# Altium schematic sheet JacDacMicroBitShieldLP 29.SchDoc: complete design
size A4; DocumentNumber: 1; SheetNumber: 1; SheetTotal: 2; VersionControl_RevNumber: 1
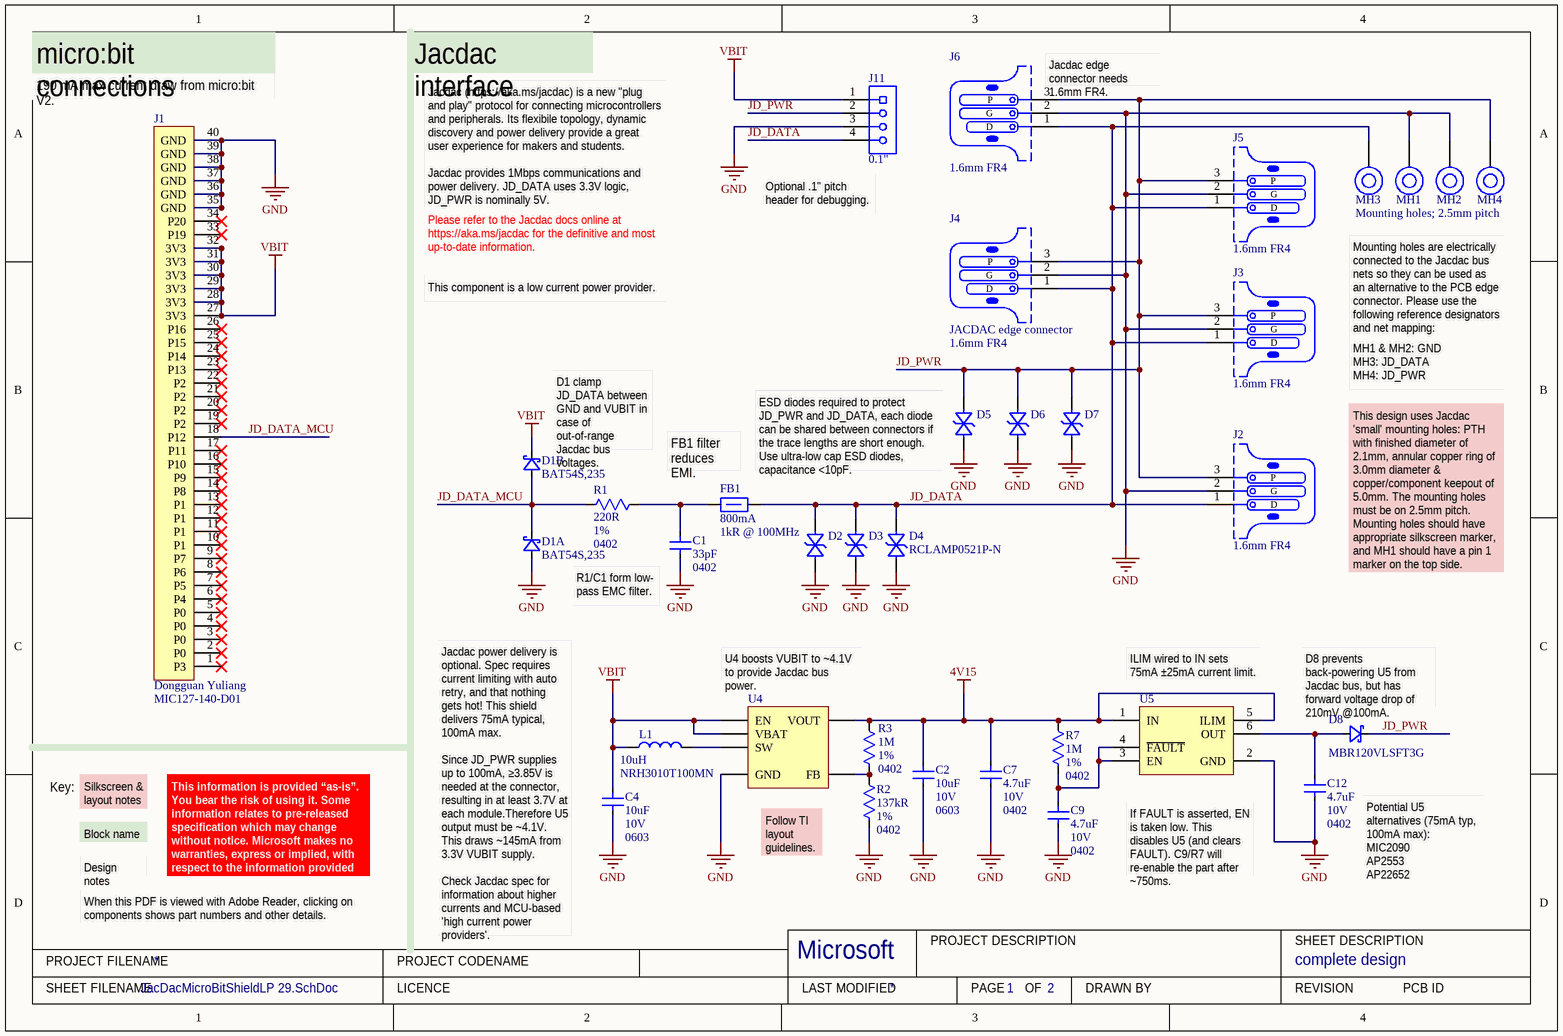
[diagram p0: JacDacMicroBitShieldLP 29.SchDoc]

## Parts
C1  Capacitance: 33pF  Case Code (Imperial): 0402  [C0402_0.55MM - without outline]  (hidden comment: CL05C330JB51PNC)
C2  Capacitance: 10uF  Voltage Rating: 10V  Case Code (Imperial): 0603  [C0603 - without outline]  (hidden comment: CL10A106KP8NNNC)
C4  Capacitance: 10uF  Voltage Rating: 10V  Case Code (Imperial): 0603  [C0603 - without outline]  (hidden comment: CL10A106KP8NNNC)
C7  Capacitance: 4.7uF  Voltage Rating: 10V  Case Code (Imperial): 0402  [R0402 - Without outline]  (hidden comment: CL05A475MP5NRNC)
C9  Capacitance: 4.7uF  Voltage Rating: 10V  Case Code (Imperial): 0402  [R0402 - Without outline]  (hidden comment: CL05A475MP5NRNC)
C12  Capacitance: 4.7uF  Voltage Rating: 10V  Case Code (Imperial): 0402  [R0402 - Without outline]  (hidden comment: CL05A475MP5NRNC)
D1  Manufacturer Part Number: BAT54S,235  [NXP-BAT54S-TO-236AB - without outline]  (hidden comment: BAT54S)  (parts A,B of 2)
D2  RCLAMP0521P-N  [TVS 0402 - L]  (value not drawn)
D3  RCLAMP0521P-N  [TVS 0402 - L]  (value not drawn)
D4  RCLAMP0521P-N  [TVS 0402 - L]
D5  RCLAMP0521P-N  [TVS 0402 - L]  (value not drawn)
D6  RCLAMP0521P-N  [TVS 0402 - L]  (value not drawn)
D7  RCLAMP0521P-N  [TVS 0402 - L]  (value not drawn)
D8  MBR120VLSFT3G  [MBR120VLSFT3G]
FB1  Current Rating: 800mA  Impedance: 1kR @ 100MHz  [TDK MPZ1608 0.8mm - without outline]  (hidden comment: TDK MPZ1608S102ATA00)
J1  Manufacturer: Dongguan Yuliang  [MIC127-140-D01]  (hidden comment: Planar 1x40p 1.27 mm pitch edge connector for the micro:bit)
J2  PCB Type: 1.6mm FR4  [JACDAC_EDGE_CONNECTOR_NO_TRACES]  (hidden comment: Jacdac edge connector)  (no BOM)
J3  PCB Type: 1.6mm FR4  [JACDAC_EDGE_CONNECTOR_NO_TRACES]  (hidden comment: Jacdac edge connector)  (no BOM)
J4  JACDAC edge connector  PCB Type: 1.6mm FR4  [JACDAC_EDGE_CONNECTOR_NO_TRACES]  (no BOM)
J5  PCB Type: 1.6mm FR4  [JACDAC_EDGE_CONNECTOR_NO_TRACES]  (hidden comment: Jacdac edge connector)  (no BOM)
J6  PCB Type: 1.6mm FR4  [JACDAC_EDGE_CONNECTOR_NO_TRACES]  (hidden comment: Jacdac edge connector)  (no BOM)
J11  0.1"  [Generic 1x4 2.54mm header]  (no BOM)
L1  Inductance: 10uH  [NRH3010T100MN]  (hidden comment: NRH3010T100MN)
MH1  (no value)  [MH_5.0MMK_3.0MMC_2.1MMD_PTH]  (no BOM)
MH2  Mounting holes; 2.5 mm pitch  [MH_5.0MMK_3.0MMC_2.1MMD_PTH]  (value not drawn)  (no BOM)
MH3  Mounting holes; 2.5mm pitch  [MH_5.0MMK_3.0MMC_2.1MMD_PTH]  (no BOM)
MH4  MH_5.0MMK_3.0MMC_2.1MMD_PTH  [MH_5.0MMK_3.0MMC_2.1MMD_PTH]  (value not drawn)  (no BOM)
R1  Resistance: 220R  Tolerance: 1%  Case Code (Imperial): 0402  [R0402 - Without outline]  (hidden comment: 0402WGF2200TCE)
R2  Resistance: 137kR  Tolerance: 1%  Case Code (Imperial): 0402  [R0402 - Without outline]  (hidden comment: RC0402FR-07137KL)
R3  Resistance: 1M  Tolerance: 1%  Case Code (Imperial): 0402  [R0402 - Without outline]  (hidden comment: 0402WGF1004TCE)
R7  Resistance: 1M  Tolerance: 1%  Case Code (Imperial): 0402  [R0402 - Without outline]  (hidden comment: 0402WGF1004TCE)
U4  TLV61220  [TI-TLV61220 - without_outline]  (value not drawn)
U5  TPS2553DBVR  [TI-TPS2553 - without_outline]  (value not drawn)

## Nets
4V15: C2.2 C7.2 R3.2 R7.2 U4.5(VOUT) U5.1(IN) U5.5(ILIM)
GND: C1.1 C2.1 C4.1 C7.1 C9.1 C12.1 D1.1(A) D2.2(A) D3.2(A) D4.2(A) D5.2(A) D6.2(A) D7.2(A) J1.35(GND) J1.36(GND) J1.37(GND) J1.38(GND) J1.39(GND) J1.40(GND) J2.2(G) J3.2(G) J4.2(G) J5.2(G) J6.2(G) J11.3 MH1.1 MH2.1 R2.1 U4.2(GND) U5.2(GND)
VBIT: C4.2 D1.2(K) J1.27(3V3) J1.28(3V3) J1.29(3V3) J1.30(3V3) J1.31(3V3) J1.32(3V3) J11.1 L1.1 U4.3(EN) U4.6(VBAT)
JD_DATA: D2.1(K) D3.1(K) D4.1(K) FB1.1 J2.1(D) J3.1(D) J4.1(D) J5.1(D) J6.1(D) J11.4 MH3.1
JD_DATA_MCU: D1.3(K) J1.18(P12) R1.1
JD_PWR: D5.1(K) D6.1(K) D7.1(K) D8.1(K) J2.3(P) J3.3(P) J4.3(P) J5.3(P) J6.3(P) J11.2 MH4.1
NetC1_2: C1.2 FB1.2 R1.2
NetC9_2: C9.2 R7.1 U5.3(EN) U5.4(~{FAULT})
NetC12_2: C12.2 D8.2(A) U5.6(OUT)
NetL1_2: L1.2 U4.1(SW)
NetR2_2: R2.2 R3.1 U4.4(FB)

Not connected (* = marked no-connect by the designer): J1 1(P3)* 2(P0)* 3(P0)* 4(P0)* 5(P0)* 6(P4)* 7(P5)* 8(P6)* 9(P7)* 10(P1)* 11(P1)* 12(P1)* 13(P1)* 14(P8)* 15(P9)* 16(P10)* 17(P11)* 19(P2)* 20(P2)* 21(P2)* 22(P2)* 23(P13)* 24(P14)* 25(P15)* 26(P16)* 33(P19)* 34(P20)*

## Notes on the sheet
- (near J1) 190 mA max current draw from micro:bit V2.
- micro:bit connections
- Jacdac interface
- (near J6) Jacdac edge connector needs 1.6mm FR4.
- Jacdac (https://aka.ms/jacdac) is a new "plug and play" protocol for connecting microcontrollers and peripherals. Its flexibile topology, dynamic discovery and power delivery provide a great user experience for makers and students.
  Jacdac provides 1Mbps communications and power delivery. JD_DATA uses 3.3V logic, JD_PWR is nominally 5V.
- (near J11) Optional .1" pitch header for debugging.
- Please refer to the Jacdac docs online at https://aka.ms/jacdac for the definitive and most up-to-date information.
- This component is a low current power provider.
- MH1 & MH2: GND
  MH3: JD_DATA
  MH4: JD_PWR
- Mounting holes are electrically connected to the Jacdac bus nets so they can be used as an alternative to the PCB edge connector. Please use the following reference designators and net mapping:
- (near D1) D1 clamp JD_DATA between GND and VUBIT in case of out-of-range Jacdac bus voltages.
- FB1 filter reduces EMI.
- ESD diodes required to protect JD_PWR and JD_DATA, each diode can be shared between connectors if the trace lengths are short enough. Use ultra-low cap ESD diodes, capacitance <10pF.
- This design uses Jacdac 'small' mounting holes: PTH with finished diameter of 2.1mm, annular copper ring of 3.0mm diameter & copper/component keepout of 5.0mm. The mounting holes must be on 2.5mm pitch.
  Mounting holes should have appropriate silkscreen marker, and MH1 should have a pin 1 marker on the top side.
- (near C1) R1/C1 form low-
  pass EMC filter.
- U4 boosts VUBIT to ~4.1V to provide Jacdac bus power.
- (near U5) ILIM wired to IN sets 75mA ±25mA current limit.
- (near D8) D8 prevents back-powering U5 from Jacdac bus, but has forward voltage drop of 210mV @100mA.
- Key:
- Block name
- Silkscreen & layout notes
- Follow TI layout guidelines.
- Design notes
- When this PDF is viewed with Adobe Reader, clicking on components shows part numbers and other details.
- This information is provided “as-is”. You bear the risk of using it. Some information relates to pre-released specification which may change without notice. Microsoft makes no warranties, express or implied, with respect to the information provided here.
- If FAULT is asserted, EN is taken low. This disables U5 (and clears FAULT). C9/R7 will re-enable the part after ~750ms.
- Potential U5 alternatives (75mA typ, 100mA max):
  MIC2090
  AP2553
  AP22652
- (near C4) Jacdac power delivery is optional. Spec requires current limiting with auto retry, and that nothing gets hot! This shield delivers 75mA typical, 100mA max.
  Since JD_PWR supplies up to 100mA, ≥3.85V is needed at the connector, resulting in at least 3.7V at each module.Therefore U5 output must be ~4.1V. This draws ~145mA from 3.3V VUBIT supply.
  Check Jacdac spec for information about higher currents and MCU-based 'high current power providers'.
- PROJECT FILENAME
- PROJECT CODENAME
- Microsoft
- PROJECT DESCRIPTION
- SHEET DESCRIPTION
- SHEET FILENAME
- LICENCE
- LAST MODIFIED
- PAGE
- OF
- DRAWN BY
- REVISION
- PCB ID

## Library data of the parts
C1 = CL05C330JB51PNC: CAP CER 33PF 50V NP0 0402; Manufacturer: Samsung; Tolerance: 5%; Supplier 1: Digi-Key; Manufacturer Part Number: CL05C330JB51PNC; RoHS: Yes; Category: Capacitors; Stock 1: 250654; Pricing 1: 1=0.10000, 10=0.07500, 50=0.04060, 100=0.03320, 500=0.02374, 1000=0.01865, 2500=0.01696, 5000=0.01560 (USD); Mount: Surface Mount; Case/Package: 0402; Case Code (Metric): 1005; Min Operating Temperature: -55°C; Max Operating Temperature: 125°C; Packaging: Tape and Reel; Length: 0.039inch; Width: 0.02inch; Thickness: 0.022inch; Ratings: AEC-Q200; Lead Free: Lead Free; ComponentLink1URL: http://www.samsungsem.com/kr/support/library/product-catalog/mlcc.jsp; ComponentLink1Description: Samsung datasheet online; Supplier 2: Mouser; Stock 2: 97900; Pricing 2: 1=0.11000, 10=0.08200, 100=0.03600, 500=0.02600, 1000=0.02000, 2500=0.01800 (USD); Supplier 3: Future Electronics; Stock 3: 100000; Pricing 3: 10000=0.00780 (USD); Supplier Part Number 3: 6022520; Supplier Part Number 2: 187-CL05C330JB51PNC; Checked: ?; Created: DG; Supplier Part Number 1: 1276-6515-1-ND; Voltage Rating: 50V
C2 C4 = CL10A106KP8NNNC: CAP CER 10UF 10V X5R 0603; Manufacturer: Samsung; Material: Ceramic; Tolerance: 10%; Supplier 1: Digi-Key; Manufacturer Part Number: CL10A106KP8NNNC; RoHS: Yes; Category: Ceramic Capacitors; Stock 1: 1098575; Pricing 1: 1=0.21000, 10=0.14800, 50=0.08420, 100=0.06980, 500=0.04892, 1000=0.04050 (USD); Mount: Surface Mount; Case/Package: 0603; Case Code (Metric): 1608; Contact Plating: Tin; Min Operating Temperature: -55°C; Max Operating Temperature: 85°C; Dielectric: X5R; Package Quantity: 1; Packaging: Tape and Reel; Length: 1.6mm; Width: 0.031inch; Height: 0.8mm; Thickness: 0.035inch; Depth: 0.8mm; Radiation Hardening: No; Lead Free: Lead Free; ComponentLink1URL: https://datasheet.ciiva.com/26877/getdatasheetpartid-359551-26877881.pdf; ComponentLink1Description: Online datasheet; Supplier 2: Mouser; Stock 2: 194338; Pricing 2: 1=0.19000, 10=0.13200, 100=0.06700, 500=0.04500, 1000=0.04000, 2500=0.03400 (USD); Supplier 3: Farnell; Stock 3: 11777; Pricing 3: 10=0.08380, 100=0.06930, 500=0.04170, 1000=0.03410, 2000=0.03370, 4000=0.02700, 20000=0.02200 (GBP); Supplier Part Number 3: 3013386; Supplier Part Number 2: 187-CL10A106KP8NNNC; Supplier Part Number 1: 1276-1192-1-ND; Voltage Rating (DC): 10V
C7 C9 C12 = CL05A475MP5NRNC: CAP CER 4.7UF 10V X5R 0402; Manufacturer: Samsung; Tolerance: 20%; Supplier 1: Digi-Key; Manufacturer Part Number: CL05A475MP5NRNC; RoHS: Yes; Category: Ceramic Capacitors; Stock 1: 840000; Pricing 1: 10000=0.01405, 20000=0.01338 (USD); Mount: Surface Mount; Case/Package: 0402; Case Code (Metric): 1005; Min Operating Temperature: -55°C; Max Operating Temperature: 85°C; Package Quantity: 10000; Packaging: Tape and Reel; Dielectric: X5R; Series: CL; Length: 0.039inch; Width: 0.02inch; Thickness: 0.022inch; Lead Free: Lead Free; RoHS Compliant: Yes; ComponentLink1URL: https://datasheet.ciiva.com/25786/cl05a475mp5nrnc-25786963.pdf; ComponentLink1Description: Online datasheet; Supplier 2: Future Electronics; Stock 2: 2004; Pricing 2: 1=0.23500, 500=0.03970, 1500=0.02900, 2500=0.02500, 5000=0.02050 (USD); Created By: D. Gakure; Checked By: ?; Supplier Part Number 2: 2103694; Supplier Part Number 1: 1276-1482-2-ND
D1 = BAT54S: DIODE ARRAY SCHOTTKY 30V SOT23; Manufacturer: Nexperia; Supplier 1: Digi-Key; RoHS: No; Category: Rectifier Diodes; Stock 1: 14011; Pricing 1: 1=0.13000, 10=0.11900, 100=0.05610, 500=0.03326, 1000=0.02185, 5000=0.02138 (USD); ComponentLink1URL: https://assets.nexperia.com/documents/data-sheet/BAT54_SER.pdf; ComponentLink1Description: NXP datasheet online; Supplier 2: Mouser; Supplier 3: RSComponents; Supplier Part Number 2: 771-BAT54S235; Supplier Part Number 3: 1707990; Supplier Part Number 1: 1727-1868-1-ND
D2-D7 = RCLAMP0521P-N: Bidirectional 5V (Max) 6V 16V 3.5A (8/20us) 0402 TVS RoHS; Manufacturer: Born Semiconductor; Package: 0402; Created By: D Gakure; Checked By: ?; Supplier1: LCSC; Supplier1 Part Number: C316043; ComponentLink1Description: Online datasheet; ComponentLink1URL: https://datasheet.lcsc.com/szlcsc/Bourne-Semicon-Shenzhen-RCLAMP0521P-N_C316043.pdf; Manufacturer Part Number: RCLAMP0521P-N
D8 = MBR120VLSFT3G: DIODE SCHOTTKY 20V 1A SOD123FL; Manufacturer: ON Semiconductor; Max Surge Current: 45A; Forward Voltage: 340mV; Peak Reverse Current: 600uA; Element Configuration: Single; Polarity: Standard; Supplier 1: Digi-Key; RoHS: Yes; Category: Schottky Diodes; Stock 1: 32481; Pricing 1: 1=0.39000, 10=0.28600, 100=0.19920, 500=0.12616, 1000=0.10292, 2000=0.09960, 5000=0.09628 (USD); Number of Pins: 2; Min Operating Temperature: -65°C; Max Operating Temperature: 125°C; Package Quantity: 10000; Forward Current: 1A; Packaging: Tape and Reel; Max Reverse Leakage Current: 600uA; Average Rectified Current: 1A; Peak Non-Repetitive Surge Current: 45A; Max Repetitive Reverse Voltage (Vrrm): 20V; Max Forward Surge Current (Ifsm): 45A; Voltage Rating (DC): 20V; Current Rating: 1A; Output Current: 1A; Max Reverse Voltage (DC): 20V; Radiation Hardening: No; REACH SVHC: No SVHC; Lead Free: Lead Free; Halogen Free: Halogen Free; ComponentLink4URL: https://datasheet.ciiva.com/6380/mbr120vlsft1-d-6380910.pdf; ComponentLink4Description: On Semi datasheet online; Supplier 2: Mouser; Supplier 3: RSComponents; Supplier Part Number 3: 1867479; Supplier Part Number 2: 863-MBR120VLSFT3G; Supplier Part Number 1: MBR120VLSFT3GOSCT-ND; Manufacturer Part Number: MBR120VLSFT3G
FB1 = TDK MPZ1608S102ATA00: 0603 1k@100MHz 0.8A chip; Core Material: Ferrite; Tolerance: 25%; DC Resistance (DCR): 300mR; Supplier 1: Digi-Key; Stock 1: 113542; Pricing 1: 1=0.1, 10=0.079, 25=0.0716, 50=0.0644, 100=0.0472, 250=0.03432, 500=0.03146, 1000=0.02717 (USD); Mount: Surface Mount; Case/Package: 0603; Case Code (Metric): 1608; Case Code (Imperial): 0603; Package Quantity: 4000; Packaging: Tape and Reel; Max DC Current: 800mA; Length: 0.063inch; Height: 0.037inch; Width: 0.031inch; ComponentLink2URL: https://www.mouser.co.uk/datasheet/2/400/eads_commercial_power_mpz1608_en-923650.pdf; ComponentLink2Description: datasheet online; Supplier 2: Mouser; ComponentLink3Description: datasheet; ComponentLink3URL: Y:\System\Altium\Libraries 2014\TDK\Datasheets\eads_commercial_power_mpz1608_en-923650.pdf; Supplier Part Number 1: 445-8694-1-ND; Supplier Part Number 2: 810-MPZ1608S102ATA00; Manufacturer: TDK; Manufacturer Part Number: MPZ1608S102ATA00
J1 = MIC127-140-D01: "Same plane" 1x40p 1.27mm Dongguan Yuliang BBC micro:bit edge connector; ComponentLink1Description: Yuliang drawing; ComponentLink1URL: Y:\System\Altium\Libraries 2014\Yuliang\Datasheets\YULIANG-MIC127-140-D01.pdf; Manufacturer Part Number: MIC127-140-D01; ComponentLink2Description: Yuliang drawing online; ComponentLink2URL: http://www.dgyuliang.net/d/file/Produtcs/Customized%20Connector/MICRO%20BIT%20Connector/aff70b8859d81d58072ddeb323d41b1d.pdf
J2 J3 J5 J6 = Jacdac edge connector: 3 pin jacdac edge connector 1.27mm pitch; Manufacturer Part Number: JACDAC_EDGE_CONNECTOR; Checked By: ?; Created By: D. Gakure; ComponentLink1Description: Yuliang JACDAC cable connector drawing online; ComponentLink1URL: https://github.com/microsoft/jacdac-mdk/blob/main/connector/JACDAC-Connector-by-Yuliang-2020-11-28.pdf; ComponentLink2Description: JACDAC PCB edge connector spec onlin; ComponentLink2URL: https://github.com/microsoft/jacdac-mdk/blob/main/connector/JACDAC_PCB_Edge_Connector_Drawing_JD-PEC-01_rev_01.pdf
J4 = JACDAC edge connector: 3 pin jacdac edge connector 1.27mm pitch; Manufacturer Part Number: JACDAC_EDGE_CONNECTOR; Checked By: ?; Created By: D. Gakure; ComponentLink1Description: Yuliang JACDAC cable connector drawing online; ComponentLink1URL: https://github.com/microsoft/jacdac-mdk/blob/main/connector/JACDAC-Connector-by-Yuliang-2020-11-28.pdf; ComponentLink2Description: JACDAC PCB edge connector spec onlin; ComponentLink2URL: https://github.com/microsoft/jacdac-mdk/blob/main/connector/JACDAC_PCB_Edge_Connector_Drawing_JD-PEC-01_rev_01.pdf
J11 = Header Multicomp 2211S-04G-whitesch: 2.54mm, 4x1 way, vertical, square pin, gold plate; Pitch Spacing: 2.54; No. of Contacts: 4; Gender: Header; Product Range: 2211; Contact Termination Type: Through Hole; No. of Rows: 1; SVHC: No SVHC (17-Dec-2015); Contact Resistance: 20; Contact Termination: Solder; Current Rating: 3; Insulation Resistance: 1000; Voltage Rating V AC: 250; Withstand Voltage: 600V<!--FANDB--><div class="features-and-benefits-container"><div class="features-and-benefits-description"><span class="features-benefits-value">The 2211S-04G is a 4-pin 1-row PCB Header with gold plated copper alloy contacts and a black high temperature plastic (PBT) insulator. This board-to-board holder is ideal for through hole vertical mounting.</span></div><div class="features-and-benefits-list"><ul class="features-and-benefits-list-list"><li class="features-and-benefits-list-item">3A AC/DC Rated current</li><li class="features-and-benefits-list-item">250VAC/DC Rated voltage</li><li class="features-and-benefits-list-item">20; Created By: HUGHWI; Supplier 1: Farnell; Manufacturer: Multicomp; Manufacturer Part Number: 2211S-04G; RoHS: YES; Stock 1: 2760; Pricing 1: 1=0.0973, 5=0.0918, 25=0.0864, 50=0.0808, 100=0.0753, 250=0.032 (GBP); Contact Plating: Gold Plated Contacts; Contact Material: Copper Alloy; Flammability Rating: UL94V-0; Lead Spacing: 2.54; Operating Temperature Max: 105; Operating Temperature Min: -40; Termination Method: Solder; ComponentLink1URL: http://www.farnell.com/datasheets/1518407.pdf; ComponentLink1Description: header strip datasheet; Supplier Part Number 1: 1593413
L1 = NRH3010T100MN: Inductor, Shielded, 10uH, 600mA, SMD; NRH Series; Inductance:10 H; Inductance Tolerance: 20%; Inductor Construction:Shielded; DC Resistance Max:0.35ohm; RMS Current (Irms):620mA; Saturation Current (Isat):600mA ;RoHS Compliant: Yes; Manufacturer: Taiyo Yuden; Core Material: Ferrite; DC Resistance (DCR): 350mR; Test Frequency: 100kHz; Self Resonant Frequency: 34MHz; Current Rating: 620mA; Supplier 1: Digi-Key; RoHS: Yes; Category: Fixed Inductors; Stock 1: 2000; Pricing 1: 1=0.31000, 10=0.27600, 25=0.24120, 50=0.20680, 100=0.18950, 250=0.17224, 500=0.16192, 1000=0.12402 (USD); Mount: Surface Mount; Case/Package: 3010; Min Operating Temperature: -25°C; Max Operating Temperature: 120°C; Max DC Current: 600mA; Tolerance: 20%; Termination: SMD/SMT; Package Quantity: 2000; Packaging: Tape and Reel; Shielding: Shielded; Composition: Wirewound; Saturation Current: 600mA; RMS Current (Irms): 620mA; Length: 3mm; Height: 1mm; Height - Seated (Max): 0.039inch; Depth: 3.1mm; Width: 3mm; Radiation Hardening: No; Halogen Free: Halogen Free; Lead Free: Lead Free; REACH SVHC: Unknown; ComponentLink2URL: https://datasheet.ciiva.com/1043/nrh3010t100mn-ss-1043273.pdf; ComponentLink2Description: Taiyo Yuden spec sheet online; ComponentLink3URL: https://datasheet.ciiva.com/8002/wound04-e-8002182.pdf?src-supplier=Element14; ComponentLink3Description: Taiyo Yuden data sheet (2015) online; Supplier 2: Mouser; Supplier Part Number 2: 963-NRH3010T100MN; Supplier Part Number 1: 587-2575-1-ND; Manufacturer Part Number: NRH3010T100MN
MH1-MH4 = MH_5.0MMK_3.0MMC_2.1MMD_PTH: Mounting Hole 5.0mm keepout, 3.0mm annualar ring and 2.1mm Drill PTH
R1 = 0402WGF2200TCE: RES SMD 220 OHM 1% 1/16W 0402; Manufacturer: Uniroyal Elec; Manufacturer Part Number: 0402WGF2200TCE
R2 = RC0402FR-07137KL: RES SMD 137K OHM 1% 1/16W 0402; Manufacturer: Yageo; Temperature Coefficient: 100ppm/°C; Power Rating: 62.5mW; Voltage Rating: 50V; Max Power Dissipation: 63mW; Supplier 1: Digi-Key; Manufacturer Part Number: RC0402FR-07137KL; RoHS: Yes; Category: Chip SMD Resistors; Stock 1: 47599; Pricing 1: 1=0.10000, 10=0.01600, 100=0.00660, 1000=0.00299, 2500=0.00259, 5000=0.00214 (USD); Case/Package: 0402; Contact Plating: Tin,Matte; Case Code (Metric): 1005; Min Operating Temperature: -55°C; Max Operating Temperature: 155°C; Resistor Type: Thick Film; Packaging: Tape and Reel; Number of Terminations: 2; Termination: SMD/SMT; Working Voltage: 50V; Features: Moisture Resistant; Series: RC; Construction: Rectangular; Technology: THICK FILM; Length: 1mm; Width: 0.02inch; Height: 0.016inch; Depth: 0.5mm; Military Standard: Not; Lead Free: Lead Free; RoHS Compliant: Yes; ComponentLink1URL: https://datasheet.ciiva.com/16744/pyu-rc0402-51-rohs-l-6-r-16744009.pdf; ComponentLink1Description: Online datasheet; Supplier 2: Avnet; Pricing 2: 10000=0.00090, 20000=0.00088, 40000=0.00086, 60000=0.00084, 80000=0.00081, 100000=0.00079, 1000000=0.00077 (USD); Supplier 3: Mouser; Pricing 3: 1=0.10000, 10=0.01600, 50=0.01600, 100=0.00600, 1000=0.00300, 10000=0.00100 (USD); Supplier Part Number 3: 603-RC0402FR-07137KL; Supplier Part Number 2: RC0402FR-07137KL; Supplier Part Number 1: YAG2972CT-ND
R3 R7 = 0402WGF1004TCE: RES SMD 1M OHM 1% 1/16W 0402; Manufacturer: Uniroyal Elec; Manufacturer Part Number: 0402WGF1004TCE
U4 = TLV61220: IC REG BST ADJ 0.22A SYNC SOT23; Manufacturer 1: Texas Instruments; Manufacturer Part Number: TLV61220DBVR; Output Voltage: 5.5V; Number of Outputs: 1; Output Current: 200mA; Min Input Voltage: 700mV; Synchronous Rectifier: Yes; Switching Frequency: 2MHz; Max Output Current: 400mA; Output Type: Adjustable; Efficiency: 95%; Min Output Voltage: 1.8V; Quiescent Current: 5uA; Topology: Boost; Output Configuration: Positive; Supplier 1: Digi-Key; RoHS: Yes; Category: Voltage Regulators - Switching; Stock 1: 42159; Pricing 1: 1=0.99000, 10=0.88500, 25=0.84000, 100=0.64500, 250=0.57000, 500=0.54000, 1000=0.42000 (USD); Mount: Surface Mount; Case/Package: SOT-23-6; Number of Pins: 6; Min Operating Temperature: -40°C; Max Operating Temperature: 85°C; Package Quantity: 1; Packaging: Tape and Reel; Max Input Voltage: 5.5V; Max Output Voltage: 5.5V; Length: 3.05mm; Height: 1.3mm; Width: 1.75mm; Radiation Hardening: No; Lead Free: Lead Free; REACH SVHC: No SVHC; ComponentLink5URL: https://www.ti.com/lit/ds/symlink/tlv61220.pdf; ComponentLink5Description: Datasheet (online); Supplier 2: Farnell; Supplier 3: Mouser; Supplier Part Number 3: 595-TLV61220DBVR; Supplier Part Number 2: 3007284; Supplier Part Number 1: 296-30547-1-ND; ComponentLink6Description: Datasheet (offline); ComponentLink6URL: Y:\System\Altium\Libraries 2014\TexasInstruments\datasheets\tlv61220.pdf
U5 = TPS2553DBVR: POWER LOAD SWITCH, HIGH SIDE, SOT-23-6; Power Load Switch Type:High Side; Input Voltage:6.5V; Current Limit:1.7A; On State Resistance:0.085ohm; Distribution Switch Case Style:SOT-23; No. of Pins:6; Thermal Protection:Yes; On / Enable;RoHS Compliant: Yes; Manufacturer 1: Texas Instruments; Number of Outputs: 1; Min Supply Voltage: 2.5V; Max Supply Voltage: 6.5V; On-State Resistance: 85mR; Output Current: 1.5A; Max Power Dissipation: 625mW; Supplier 1: Digi-Key; RoHS: Yes; Category: Hot Swap Controllers; Stock 1: 14713; Pricing 1: 1=1.20000, 10=1.07100, 25=1.01640, 100=0.78050, 250=0.68972, 500=0.65340, 1000=0.50820 (USD); Case/Package: SOT-23; Number of Pins: 6; Weight: 0.00127oz; Min Operating Temperature: -40°C; Max Operating Temperature: 85°C; Packaging: Tape and Reel; Package Quantity: 1; Max Input Voltage: 6.5V; Min Input Voltage: 2.5V; Radiation Hardening: No; Lead Free: Lead Free; REACH SVHC: No SVHC; ComponentLink1URL: https://datasheet.ciiva.com/15108/getdatasheetpartid-297517-15108509.pdf?src-supplier=Verical; ComponentLink1Description: https://datasheet.ciiva.com/15108/getdatasheetpartid-297517-15108509.pdf?src-supplier=Verical; Supplier 2: Farnell; Supplier 3: Mouser; Supplier Part Number 3: 595-TPS2553DBVR; Supplier Part Number 2: 3124082; Supplier Part Number 1: 296-32464-1-ND; Manufacturer Part Number: TPS2553DBVR